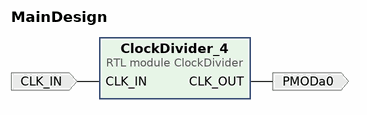
[diagram p0: block diagram of the top level]
# Vivado block design MainDesign, xc7z020clg400-1, Vivado 2024.1
create_bd_design MainDesign

create_bd_port -dir I -type clk CLK_IN
set_property -dict {CONFIG.FREQ_HZ 125000000} [get_bd_ports CLK_IN]
create_bd_port -dir O PMODa0

create_bd_cell -type module -reference ClockDivider ClockDivider_4
set_property -dict {CONFIG.DIVISOR 0x7735940} [get_bd_cells ClockDivider_4]

# ---- connections ----

connect_bd_net [get_bd_ports CLK_IN] [get_bd_pins ClockDivider_4/CLK_IN]
connect_bd_net [get_bd_pins ClockDivider_4/CLK_OUT] [get_bd_ports PMODa0]

validate_bd_design
save_bd_design
